# EAGLE schematic NinjaPCB-2x2-MooMoo_ver2.0 (EAGLE 6.6.0)
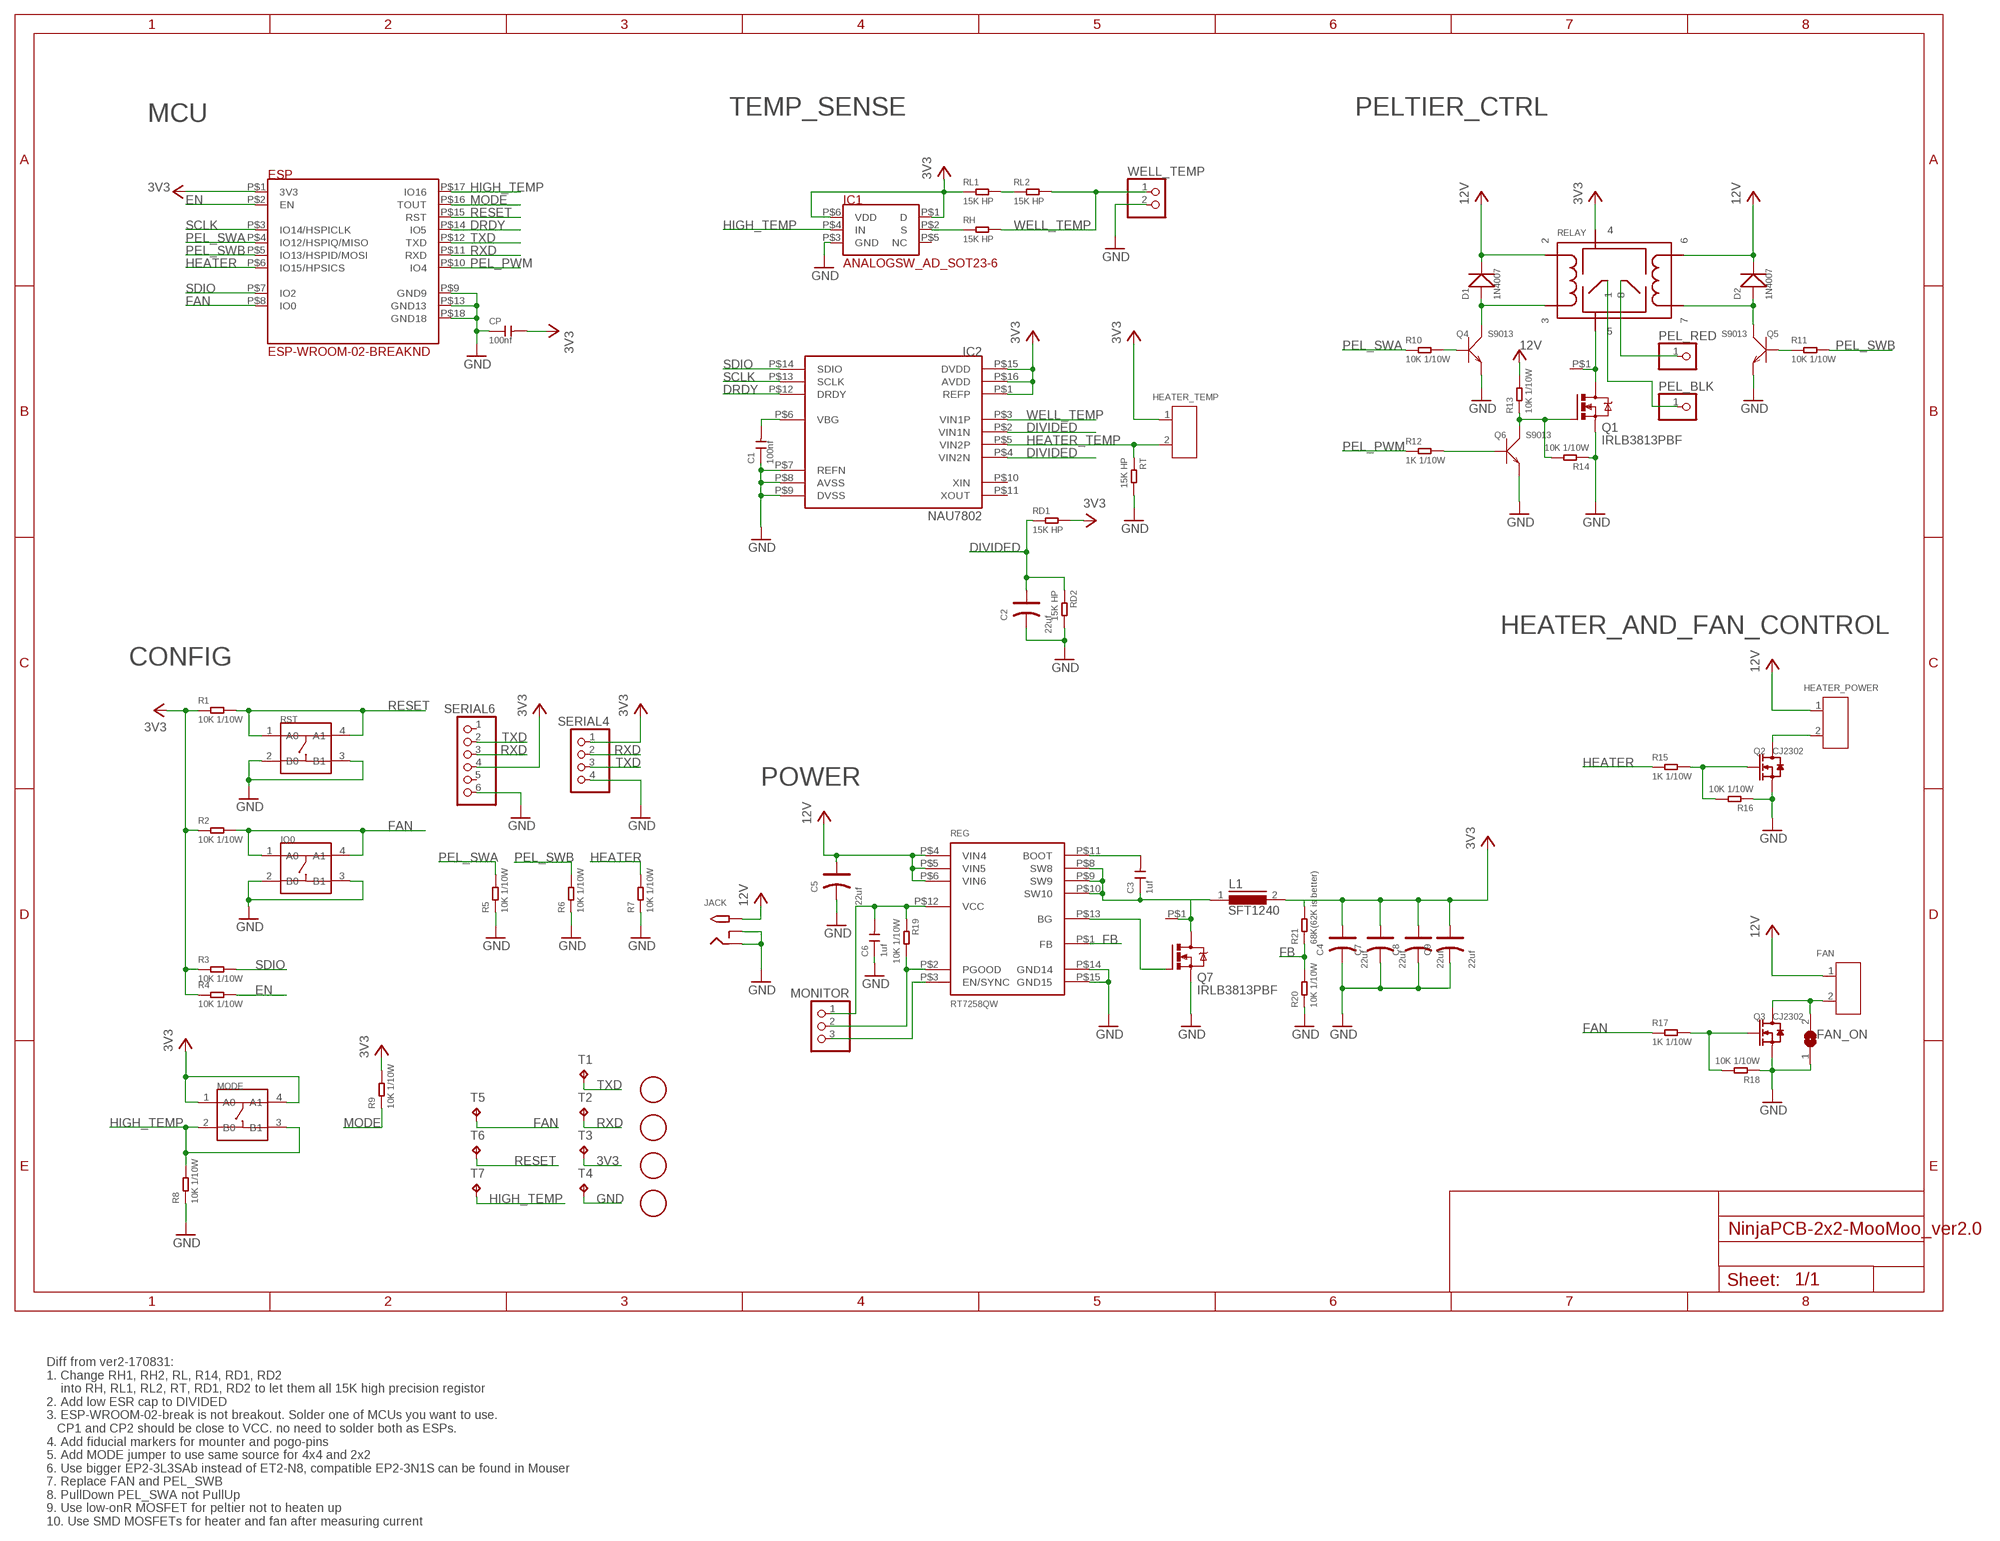
[diagram p0: schematic, sheet 1]

## Parts
C1  100nf  CERAMIC-100NF-50V-10%-X7R(0603)  [C0603]
C2  22uf  TANTALUM-SMD-22UF-16V(AVX-B)  [AVX-B]
C3  1uf  CERAMIC-1UF-25V-10%-X7R(0603)  [C0603]
C4  22uf  TANTALUM-SMD-22UF-16V(AVX-B)  [AVX-B]
C5  22uf  TANTALUM-SMD-22UF-16V(AVX-B)  [AVX-B]
C6  1uf  CERAMIC-1UF-25V-10%-X7R(0603)  [C0603]
C7  22uf  TANTALUM-SMD-22UF-16V(AVX-B)  [AVX-B]
C8  22uf  TANTALUM-SMD-22UF-16V(AVX-B)  [AVX-B]
C9  22uf  TANTALUM-SMD-22UF-16V(AVX-B)  [AVX-B]
CP  100nf  CERAMIC-100NF-50V-10%-X7R(0603)  [C0603]
D1  1N4007  DIODE-GEN-PURPOSE-1KV-1A(DO-214AC)  [DO-214AC]
D2  1N4007  DIODE-GEN-PURPOSE-1KV-1A(DO-214AC)  [DO-214AC]
ESP  ESP-WROOM-02-BREAKND  [ESP-WROOM-02-BREAK-NODETAIL]
FAN  SCREW-TERMINAL-GREEN(2P-3.5)  [H2-3.5-7.0X7.0MM]
FAN_ON  SJ  [SJ]
HEATER_POWER  SCREW-TERMINAL-GREEN(2P-3.5)  [H2-3.5-7.0X7.0MM]
HEATER_TEMP  SCREW-TERMINAL-GREEN(2P-3.5)  [H2-3.5-7.0X7.0MM]
HEATSINK  HEAT111PB015  [HEAT11PB015]
HEATSINK1  HEAT111PB015  [HEAT11PB015]
IC1  ANALOGSW_AD_SOT23-6  [SOT-23-6]
IC2  NAU7802  [SOP-16]
IO0  DIP-SWITCH-TACTILE-SPST-NO/TS-1109(4P-D6.0MM)'TS-1109'  [SW4-6.0X6.0X5.0MM]
JACK  2.1MMJACKTHM-NOOUT  [PJ-102A-NOOUT]
L1  SFT1240  [SFT1240]
MODE  DIP-SWITCH-TACTILE-SPST-NO/TS-1109(4P-D6.0MM)'TS-1109'  [SW4-6.0X6.0X5.0MM]
MONITOR  PINHD-1X3  [1X03]
PEL_BLK  PINHD-1X1L  [1X01LONG]
PEL_RED  PINHD-1X1L  [1X01LONG]
Q1  IRLB3813PBF  IRF520  [TO220BV]
Q2  CJ2302  SMD-MOSFET-N-CH-20V-2.1A-CJ2302(SOT-23)  [SOT-23]
Q3  CJ2302  SMD-MOSFET-N-CH-20V-2.1A-CJ2302(SOT-23)  [SOT-23]
Q4  S9013  SMD-TRANSISTORS-NPN-25V-500MA-S9013(SOT-23)  [SOT-23]
Q5  S9013  SMD-TRANSISTORS-NPN-25V-500MA-S9013(SOT-23)  [SOT-23]
Q6  S9013  SMD-TRANSISTORS-NPN-25V-500MA-S9013(SOT-23)  [SOT-23]
Q7  IRLB3813PBF  IRF520  [TO220BV]
R1  10K 1/10W  SMD-RES-10K-5%-1/10W(0603)  [R0603]
R2  10K 1/10W  SMD-RES-10K-5%-1/10W(0603)  [R0603]
R3  10K 1/10W  SMD-RES-10K-5%-1/10W(0603)  [R0603]
R4  10K 1/10W  SMD-RES-10K-5%-1/10W(0603)  [R0603]
R5  10K 1/10W  SMD-RES-10K-5%-1/10W(0603)  [R0603]
R6  10K 1/10W  SMD-RES-10K-5%-1/10W(0603)  [R0603]
R7  10K 1/10W  SMD-RES-10K-5%-1/10W(0603)  [R0603]
R8  10K 1/10W  SMD-RES-10K-5%-1/10W(0603)  [R0603]
R9  10K 1/10W  SMD-RES-10K-5%-1/10W(0603)  [R0603]
R10  10K 1/10W  SMD-RES-10K-5%-1/10W(0603)  [R0603]
R11  10K 1/10W  SMD-RES-10K-5%-1/10W(0603)  [R0603]
R12  1K 1/10W  SMD-RES-1K-5%-1/10W(0603)  [R0603]
R13  10K 1/10W  SMD-RES-10K-5%-1/10W(0603)  [R0603]
R14  10K 1/10W  SMD-RES-10K-5%-1/10W(0603)  [R0603]
R15  1K 1/10W  SMD-RES-1K-5%-1/10W(0603)  [R0603]
R16  10K 1/10W  SMD-RES-10K-5%-1/10W(0603)  [R0603]
R17  1K 1/10W  SMD-RES-1K-5%-1/10W(0603)  [R0603]
R18  10K 1/10W  SMD-RES-10K-5%-1/10W(0603)  [R0603]
R19  10K 1/10W  SMD-RES-10K-5%-1/10W(0603)  [R0603]
R20  10K 1/10W  SMD-RES-10K-5%-1/10W(0603)  [R0603]
R21  68K(62K is better)  SMD-RES-30K-5%-1/10W(0603)  [R0603]
RD1  15K HP  R0603  [R0603]
RD2  15K HP  R0603  [R0603]
REG  RT7258QW  [RT7258GQW]
RELAY  NEC-RELAY2EP2  [NEC-EP2]
RH  15K HP  R0603  [R0603]
RL1  15K HP  R0603  [R0603]
RL2  15K HP  R0603  [R0603]
RST  DIP-SWITCH-TACTILE-SPST-NO/TS-1109(4P-D6.0MM)'TS-1109'  [SW4-6.0X6.0X5.0MM]
RT  15K HP  SMD-RES-2K-1%-1/10W(0603)  [R0603]
SERIAL4  PINHD-1X4  [1X04]
SERIAL6  PINHD-1X6  [1X06]
T1  TPTP20R  [TP20R]
T2  TPTP20R  [TP20R]
T3  TPTP20R  [TP20R]
T4  TPTP20R  [TP20R]
T5  TPTP20R  [TP20R]
T6  TPTP20R  [TP20R]
T7  TPTP20R  [TP20R]
U$3  FIDUCIAL  [FIDUCIAL_1MM]
U$4  FIDUCIAL  [FIDUCIAL_1MM]
U$5  FIDUCIAL  [FIDUCIAL_1MM]
U$6  FIDUCIAL  [FIDUCIAL_1MM]
WELL_TEMP  PINHD-1X2  [1X02]

## Nets
3V3: C4.+ C7.+ C8.+ C9.+ CP.2 ESP.P$1(3V3) HEATER_TEMP.1 IC1.P$1(D) IC1.P$6(VDD) IC2.P$1(REFP) IC2.P$15(DVDD) IC2.P$16(AVDD) L1.2 MODE.1(A0) MODE.4(A1) R1.1 R2.1 R3.1 R4.1 R9.2 R21.2 RD1.2 RELAY.P$4 RL1.1 SERIAL4.1 SERIAL6.4 T3.TP
12V: C5.+ D2.2(-) FAN.1 HEATER_POWER.1 JACK.TIP R13.2 REG.P$4(VIN4) REG.P$5(VIN5) REG.P$6(VIN6) RELAY.P$6
DIVIDED: C2.+ IC2.P$2(VIN1N) IC2.P$4(VIN2N) RD1.1 RD2.1
DRDY: ESP.P$14(IO5) IC2.P$12(DRDY)
EN: ESP.P$2(EN) R4.2
FAN: ESP.P$8(IO0) IO0.1(A0) IO0.4(A1) R2.2 R17.1 T5.TP
FB: R20.2 R21.1 REG.P$1(FB)
GND: C1.1 C2.- C4.- C5.- C6.1 C7.- C8.- C9.- CP.1 ESP.P$9(GND9) ESP.P$13(GND13) ESP.P$18(GND18) FAN_ON.1 IC1.P$3(GND) IC2.P$7(REFN) IC2.P$8(AVSS) IC2.P$9(DVSS) IO0.2(B0) IO0.3(B1) JACK.RING JACK.RING_SW Q1.S Q2.2(S) Q3.2(S) Q4.2(E) Q5.2(E) Q6.2(E) Q7.S R5.1 R6.1 R7.1 R8.1 R14.1 R16.1 R18.1 R20.1 RD2.2 REG.P$14(GND14) REG.P$15(GND15) RST.2(B0) RST.3(B1) RT.2 SERIAL4.4 SERIAL6.6 T4.TP WELL_TEMP.2
HEATER: ESP.P$6(IO15/HPSICS) R7.2 R15.1
HEATER_TEMP: HEATER_TEMP.2 IC2.P$5(VIN2P) RT.1
HIGH_TEMP: ESP.P$17(IO16) IC1.P$4(IN) MODE.2(B0) MODE.3(B1) R8.2 T7.TP
MODE: ESP.P$16(TOUT) R9.1
N$1: RL1.2 RL2.1
N$2: HEATER_POWER.2 Q2.3(D)
N$3: HEATSINK.P$1 Q1.D RELAY.P$5
N$4: FAN.2 FAN_ON.2 Q3.3(D)
N$5: Q1.G Q6.3(C) R13.1 R14.2
N$6: PEL_RED.1 RELAY.P$8
N$7: PEL_BLK.1 RELAY.P$1
N$8: Q3.1(G) R17.2 R18.2
N$9: D1.2(-) RELAY.P$2
N$10: C6.2 MONITOR.1 R19.1 REG.P$12(VCC)
N$11: MONITOR.2 R19.2 REG.P$2(PGOOD)
N$12: MONITOR.3 REG.P$3(EN/SYNC)
N$13: C3.2 REG.P$11(BOOT)
N$14: C3.1 HEATSINK1.P$1 L1.1 Q7.D REG.P$8(SW8) REG.P$9(SW9) REG.P$10(SW10)
N$15: Q7.G REG.P$13(BG)
N$27: IC1.P$2(S) RH.1
N$30: Q6.1(B) R12.2
N$32: Q2.1(G) R15.2 R16.2
N$33: D1.1(+) Q4.3(C) RELAY.P$3
N$34: Q4.1(B) R10.2
N$35: Q5.1(B) R11.1
N$36: D2.1(+) Q5.3(C) RELAY.P$7
N$92: C1.2 IC2.P$6(VBG)
PEL_PWM: ESP.P$10(IO4) R12.1
PEL_SWA: ESP.P$4(IO12/HSPIQ/MISO) R5.2 R10.1
PEL_SWB: ESP.P$5(IO13/HSPID/MOSI) R6.2 R11.2
RESET: ESP.P$15(RST) R1.2 RST.1(A0) RST.4(A1) T6.TP
RXD: ESP.P$11(RXD) SERIAL4.2 SERIAL6.3 T2.TP
SCLK: ESP.P$3(IO14/HSPICLK) IC2.P$13(SCLK)
SDIO: ESP.P$7(IO2) IC2.P$14(SDIO) R3.2
TXD: ESP.P$12(TXD) SERIAL4.3 SERIAL6.2 T1.TP
WELL_TEMP: IC2.P$3(VIN1P) RH.2 RL2.2 WELL_TEMP.1
Unconnected: IC1.P$5(NC) IC2.P$10(XIN) IC2.P$11(XOUT) SERIAL6.1 SERIAL6.5

## Notes on the sheet
- MCU | TEMP_SENSE | PELTIER_CTRL
- HEATER_AND_FAN_CONTROL
- CONFIG
- POWER
- Diff from ver2-170831: 
  1. Change RH1, RH2, RL, R14, RD1, RD2 
      into RH, RL1, RL2, RT, RD1, RD2 to let them all 15K high precision registor
  2. Add low ESR cap to DIVIDED
  3. ESP-WROOM-02-break is not breakout. Solder one of MCUs you want to use.
     CP1 and CP2 should be close to VCC. no need to solder both as ESPs.
  4. Add fiducial markers for mounter and pogo-pins
  5. Add MODE jumper to use same source for 4x4 and 2x2
  6. Use bigger EP2-3L3SAb instead of ET2-N8, compatible EP2-3N1S can be found in Mouser
  7. Replace FAN and PEL_SWB
  8. PullDown PEL_SWA not PullUp
  9. Use low-onR MOSFET for peltier not to heaten up
  10. Use SMD MOSFETs for heater and fan after measuring current

## Library data of the parts
C1 CP = Seeed-Capacitor:CERAMIC-100NF-50V-10%-X7R(0603): 302010138; MPN: CC0603KRX7R9BB104
C2 C4 C5 C7-C9 = Seeed-Capacitor:TANTALUM-SMD-22UF-16V(AVX-B): 302020013; MPN: TAJB226*016#NJ
C3 C6 = Seeed-Capacitor:CERAMIC-1UF-25V-10%-X7R(0603): 302010139; MPN: CC0603KRX7R8BB105
D1 D2 = Seeed-Diode:DIODE-GEN-PURPOSE-1KV-1A(DO-214AC): 304010013; MPN: 1N4007
ESP = PCR-Module:ESP-WROOM-02-BREAK
FAN HEATER_POWER HEATER_TEMP = Seeed-Connector:SCREW-TERMINAL-GREEN(2P-3.5): 320110028; VALUE: GREEN-2P-3.5
FAN_ON = jumper:SJ: SMD solder JUMPER
HEATSINK HEATSINK1 = PCR-Connector:HEAT1
IC1 = PCR-IC:ANALOGSW_AD_SOT23-6
IC2 = PCR-IC:NAU7802
IO0 MODE RST = Seeed-Switch:DIP-SWITCH-TACTILE-SPST-NO/TS-1109(4P-D6.0MM): 311020024
JACK = adafruit:2.1MMJACK: 2.1mm x 5.5mm THM DC jack with internal switch. Digikey part #PJ-102A, 4UCON part #05537 2.1mm x 5.5mm SMT DC jack with internal switch. Digikey part #PJ-002A-SMT, 4UCON part #03267 By microbuilder.eu & adafruit.com
L1 = inductors:SFT1240: INDUCTOR
MONITOR = pinhead:PINHD-1X3: PIN HEADER
PEL_BLK PEL_RED = pinhead:PINHD-1X1: PIN HEADER
Q1 Q7 = transistor-power:IRF520: HEXFET Power MOSFET
Q2 Q3 = Seeed-Transistor:SMD-MOSFET-N-CH-20V-2.1A-CJ2302(SOT-23): 305030015; MPN: CJ2302
Q4-Q6 = Seeed-Transistor:SMD-TRANSISTORS-NPN-25V-500MA-S9013(SOT-23): 305010018; MPN: S9013
R1-R11 R13 R14 R16 R18-R20 = Seeed-Resistor:SMD-RES-10K-5%-1/10W(0603): 301010293; MPN: RC0603JR-0710KL
R12 R15 R17 = Seeed-Resistor:SMD-RES-1K-5%-1/10W(0603): 301010291; MPN: RC0603JR-071KL
R21 = Seeed-Resistor:SMD-RES-30K-5%-1/10W(0603): 301010162
RD1 RD2 RH RL1 RL2 = PCR-RCL:R
REG = PCR-IC:RT7258
RELAY = PCR-Switch:NEC-RELAY2
RT = Seeed-Resistor:SMD-RES-2K-1%-1/10W(0603): 301010221; MPN: RC0603FR-072KL; VALUE: 2K
SERIAL4 = pinhead:PINHD-1X4: PIN HEADER
SERIAL6 = pinhead:PINHD-1X6: PIN HEADER
T1-T7 = testpad:TP: Test pad
U$3-U$6 = adafruit:FIDUCIAL: For use by pick and place machines to calibrate the vision/machine, 1mm By microbuilder.eu
WELL_TEMP = pinhead:PINHD-1X2: PIN HEADER

## Net classes
1 2A: width 0.406 mm
2 8A: width 2.54 mm